# EAGLE design ardugilla-ver8 (EAGLE 9.5.1)
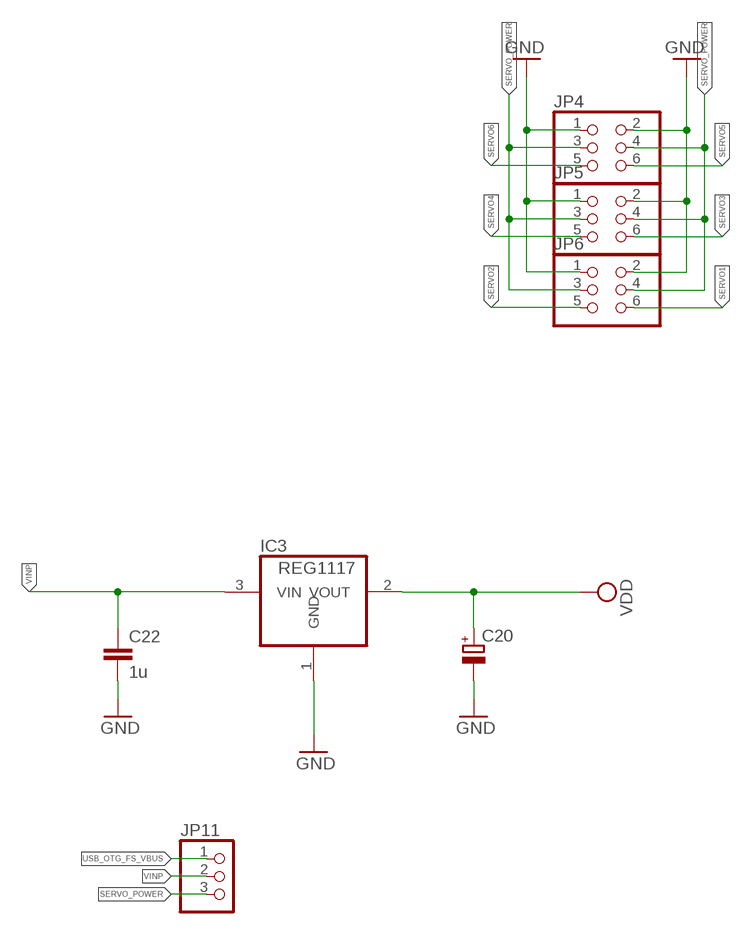
[diagram p0: schematic, sheet 1, part 1 of 2]
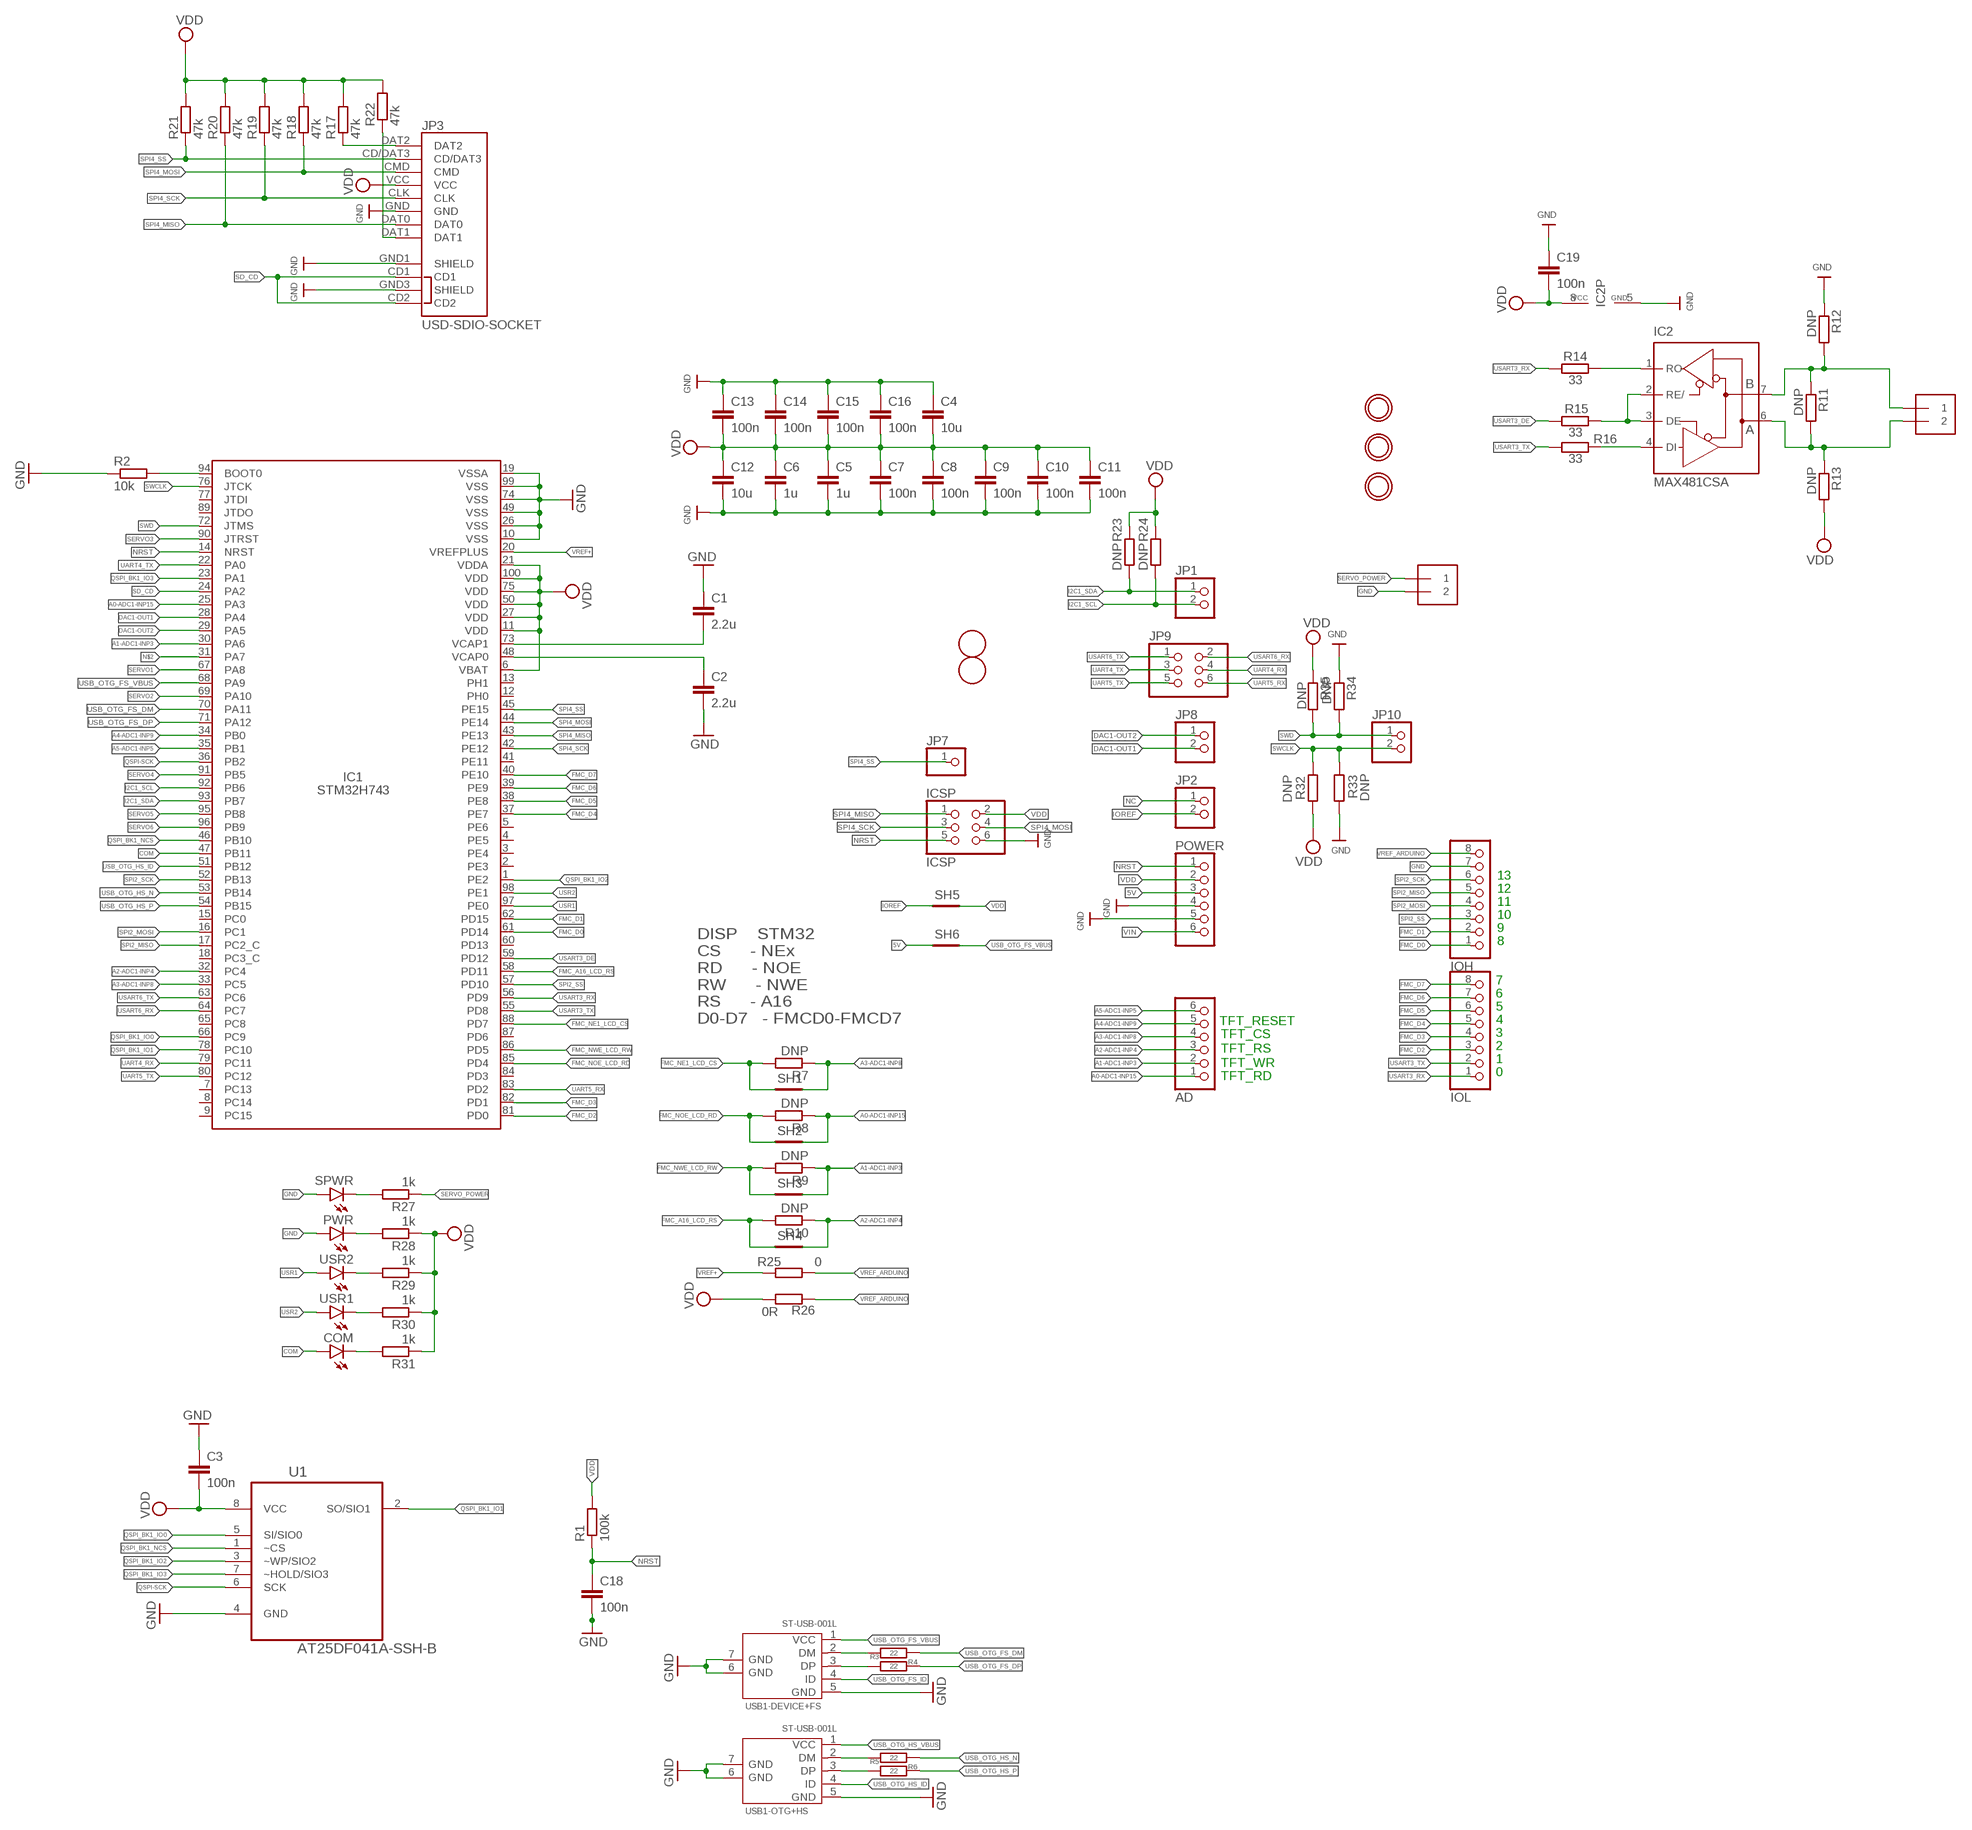
[diagram p1: schematic, sheet 1, part 2 of 2]

## Parts
AD  PINHD-1X6  [1X06]
C1  2.2u  C-EUC0603  [C0603]
C2  2.2u  C-EUC0603  [C0603]
C3  100n  C-EUC0603  [C0603]
C4  10u  C-EUC0603  [C0603]
C5  1u  C-EUC0603  [C0603]
C6  1u  C-EUC0603  [C0603]
C7  100n  C-EUC0603  [C0603]
C8  100n  C-EUC0603  [C0603]
C9  100n  C-EUC0603  [C0603]
C10  100n  C-EUC0603  [C0603]
C11  100n  C-EUC0603  [C0603]
C12  10u  C-EUC0603  [C0603]
C13  100n  C-EUC0603  [C0603]
C14  100n  C-EUC0603  [C0603]
C15  100n  C-EUC0603  [C0603]
C16  100n  C-EUC0603  [C0603]
C18  100n  C-EUC0603  [C0603]
C19  100n  C-EUC0603  [C0603]
C20  CPOL-EUE2-4  [E2-4]
C22  1u  C-EUC0603  [C0603]
COM  LEDSML0603  [SML0603]
IC1  STM32H743  STM32H743_753_LQFP100  [LQFP100_PACKAGE]
IC2  MAX481CSA  [SO08]
IC3  REG1117  [SOT223]
ICSP  ICSP  PINHD-2X3  [2X03]
IOH  PINHD-1X8  [1X08]
IOL  PINHD-1X8  [1X08]
J1  1X2-3.5MM  [1X2-3.5MM]
J2  1X2-3.5MM  [1X2-3.5MM]
JP1  PINHD-1X2  [1X02]
JP2  PINHD-1X2  [1X02]
JP3  USD-SDIO-SOCKET  [MICRO-SD-SOCKET-SDIO]
JP4  PINHD-2X3  [2X03]
JP5  PINHD-2X3  [2X03]
JP6  PINHD-2X3  [2X03]
JP7  PINHD-1X1CB  [1X01-CLEANBIG]
JP8  PINHD-1X2  [1X02]
JP9  PINHD-2X03_2.54-90°  [2X03/90]
JP10  PINHD-1X2  [1X02]
JP11  PINHD-1X3  [1X03]
POWER  PINHD-1X6  [1X06]
PWR  LEDSML0603  [SML0603]
R1  100k  R-EU_R0603  [R0603]
R2  10k  R-EU_R0603  [R0603]
R3  22  R-EU_R0603  [R0603]
R4  22  R-EU_R0603  [R0603]
R5  22  R-EU_R0603  [R0603]
R6  22  R-EU_R0603  [R0603]
R7  DNP  R-EU_R0402  [R0402]
R8  DNP  R-EU_R0402  [R0402]
R9  DNP  R-EU_R0402  [R0402]
R10  DNP  R-EU_R0402  [R0402]
R11  DNP  R-EU_R0603  [R0603]
R12  DNP  R-EU_R0603  [R0603]
R13  DNP  R-EU_R0603  [R0603]
R14  33  R-EU_R0402  [R0402]
R15  33  R-EU_R0402  [R0402]
R16  33  R-EU_R0402  [R0402]
R17  47k  R-EU_R0603  [R0603]
R18  47k  R-EU_R0603  [R0603]
R19  47k  R-EU_R0603  [R0603]
R20  47k  R-EU_R0603  [R0603]
R21  47k  R-EU_R0603  [R0603]
R22  47k  R-EU_R0603  [R0603]
R23  DNP  R-EU_R0603  [R0603]
R24  DNP  R-EU_R0603  [R0603]
R25  0  R-EU_R0603  [R0603]
R26  0R  R-EU_R0603  [R0603]
R27  1k  R-EU_R0402  [R0402]
R28  1k  R-EU_R0603  [R0603]
R29  1k  R-EU_R0402  [R0402]
R30  1k  R-EU_R0402  [R0402]
R31  1k  R-EU_R0603  [R0603]
R32  DNP  R-EU_R0603  [R0603]
R33  DNP  R-EU_R0603  [R0603]
R34  DNP  R-EU_R0603  [R0603]
R35  DNP  R-EU_R0603  [R0603]
SH1  SHORTT5  [SHORT_TOP-50]
SH2  SHORTT5  [SHORT_TOP-50]
SH3  SHORTT5  [SHORT_TOP-50]
SH4  SHORTT5  [SHORT_TOP-50]
SH5  SHORTT5  [SHORT_TOP-50]
SH6  SHORTT5  [SHORT_TOP-50]
SPWR  LEDSML0603  [SML0603]
U1  AT25DF041A-SSH-B  [SOIC127P600X175-8N]
U$3  FIDUCIALMOUNT  [FIDUCIA-MOUNT]
U$4  FIDUCIALMOUNT  [FIDUCIA-MOUNT]
U$12  MICROBUILDER_MOUNTINGHOLE3.0THIN  [MICROBUILDER_MOUNTINGHOLE_3.0_PLATEDTHIN]
U$13  MICROBUILDER_MOUNTINGHOLE3.0THIN  [MICROBUILDER_MOUNTINGHOLE_3.0_PLATEDTHIN]
U$14  MICROBUILDER_MOUNTINGHOLE3.0THIN  [MICROBUILDER_MOUNTINGHOLE_3.0_PLATEDTHIN]
USB1-DEVICE+FS  ST-USB-001L  MICRO-USB-SMD-TYPE-AB-R/A(ST-USB-001L)  [MICRO-USB5+2P-SMD-0.65]
USB1-OTG+HS  ST-USB-001L  MICRO-USB-SMD-TYPE-AB-R/A(ST-USB-001L)  [MICRO-USB5+2P-SMD-0.65]
USR1  LEDSML0603  [SML0603]
USR2  LEDSML0603  [SML0603]

## Nets
5V: POWER.3 SH6.1
A0-ADC1-INP15: AD.1 IC1.25(PA3) R8.1 SH2.2
A1-ADC1-INP3: AD.2 IC1.30(PA6) R9.1 SH3.2
A2-ADC1-INP4: AD.3 IC1.32(PC4) R10.1 SH4.2
A3-ADC1-INP8: AD.4 IC1.33(PC5) R7.1 SH1.2
A4-ADC1-INP9: AD.5 IC1.34(PB0)
A5-ADC1-INP5: AD.6 IC1.35(PB1)
COM: COM.A IC1.47(PB11)
DAC1-OUT1: IC1.28(PA4) JP8.2
DAC1-OUT2: IC1.29(PA5) JP8.1
FMC_A16_LCD_RS: IC1.58(PD11) R10.2 SH4.1
FMC_D0: IC1.61(PD14) IOH.1
FMC_D1: IC1.62(PD15) IOH.2
FMC_D2: IC1.81(PD0) IOL.3
FMC_D3: IC1.82(PD1) IOL.4
FMC_D4: IC1.37(PE7) IOL.5
FMC_D5: IC1.38(PE8) IOL.6
FMC_D6: IC1.39(PE9) IOL.7
FMC_D7: IC1.40(PE10) IOL.8
FMC_NE1_LCD_CS: IC1.88(PD7) R7.2 SH1.1
FMC_NOE_LCD_RD: IC1.85(PD4) R8.2 SH2.1
FMC_NWE_LCD_RW: IC1.86(PD5) R9.2 SH3.1
GND: C1.1 C2.2 C3.1 C4.1 C5.2 C6.2 C7.2 C8.2 C9.2 C10.2 C11.2 C12.2 C13.1 C14.1 C15.1 C16.1 C18.2 C19.1 C20.- C22.2 IC1.10(VSS) IC1.19(VSSA) IC1.26(VSS) IC1.49(VSS) IC1.74(VSS) IC1.99(VSS) IC2.5(GND) IC3.1(GND) ICSP.6 IOH.7 J2.2 JP3.GND JP3.GND1(SHIELD) JP3.GND3(SHIELD) JP4.1 JP4.2 JP5.1 JP5.2 JP6.1 JP6.2 POWER.4 POWER.5 PWR.A R2.1 R12.1 R33.2 R34.1 SPWR.A U1.4(GND) USB1-DEVICE+FS.5(GND) USB1-DEVICE+FS.6(GND) USB1-DEVICE+FS.7(GND) USB1-OTG+HS.5(GND) USB1-OTG+HS.6(GND) USB1-OTG+HS.7(GND)
I2C1_SCL: IC1.92(PB6) JP1.2 R24.1
I2C1_SDA: IC1.93(PB7) JP1.1 R23.1
IOREF: JP2.2 SH5.1
N$1: IC1.94(BOOT0) R2.2
N$2: IC1.31(PA7)
N$3: C1.2 IC1.73(VCAP1)
N$4: C2.1 IC1.48(VCAP0)
N$5: R27.2 SPWR.C
N$6: R3.2 USB1-DEVICE+FS.2(DM)
N$7: PWR.C R28.2
N$8: R4.2 USB1-DEVICE+FS.3(DP)
N$9: R5.2 USB1-OTG+HS.2(DM)
N$10: R6.2 USB1-OTG+HS.3(DP)
N$11: R29.2 USR2.C
N$12: R30.2 USR1.C
N$13: COM.C R31.2
N$21: IC2.2(RE/) IC2.3(DE) R15.2
N$22: IC2.4(DI) R16.2
N$23: IC2.1(RO) R14.2
N$25: IC2.7(B) J1.1 R11.1 R12.2
N$26: IC2.6(A) J1.2 R11.2 R13.1
NC: JP2.1
NRST: C18.1 IC1.14(NRST) ICSP.5 POWER.1 R1.1
QSPI-SCK: IC1.36(PB2) U1.6(SCK)
QSPI_BK1_IO0: IC1.66(PC9) U1.5(SI/SIO0)
QSPI_BK1_IO1: IC1.78(PC10) U1.2(SO/SIO1)
QSPI_BK1_IO2: IC1.1(PE2) U1.3(~WP/SIO2)
QSPI_BK1_IO3: IC1.23(PA1) U1.7(~HOLD/SIO3)
QSPI_BK1_NCS: IC1.46(PB10) U1.1(~CS)
SD_CD: IC1.24(PA2) JP3.CD1 JP3.CD2
SD_DAT1: JP3.DAT1 R22.1
SD_DAT2: JP3.DAT2 R17.1
SERVO1: IC1.67(PA8) JP6.6
SERVO2: IC1.69(PA10) JP6.5
SERVO3: IC1.90(JTRST) JP5.6
SERVO4: IC1.91(PB5) JP5.5
SERVO5: IC1.95(PB8) JP4.6
SERVO6: IC1.96(PB9) JP4.5
SERVO_POWER: J2.1 JP4.3 JP4.4 JP5.3 JP5.4 JP6.3 JP6.4 JP11.3 R27.1
SPI2_MISO: IC1.17(PC2_C) IOH.5
SPI2_MOSI: IC1.16(PC1) IOH.4
SPI2_SCK: IC1.52(PB13) IOH.6
SPI2_SS: IC1.57(PD10) IOH.3
SPI4_MISO: IC1.43(PE13) ICSP.1 JP3.DAT0 R20.1
SPI4_MOSI: IC1.44(PE14) ICSP.4 JP3.CMD R18.1
SPI4_SCK: IC1.42(PE12) ICSP.3 JP3.CLK R19.1
SPI4_SS: IC1.45(PE15) JP3.CD/DAT3 JP7.1 R21.1
SWCLK: IC1.76(JTCK) JP10.2 R32.1 R33.1
SWD: IC1.72(JTMS) JP10.1 R34.2 R35.2
UART4_RX: IC1.79(PC11) JP9.4
UART4_TX: IC1.22(PA0) JP9.3
UART5_RX: IC1.83(PD2) JP9.6
UART5_TX: IC1.80(PC12) JP9.5
USART3_DE: IC1.59(PD12) R15.1
USART3_RX: IC1.56(PD9) IOL.1 R14.1
USART3_TX: IC1.55(PD8) IOL.2 R16.1
USART6_RX: IC1.64(PC7) JP9.2
USART6_TX: IC1.63(PC6) JP9.1
USB_OTG_FS_DM: IC1.70(PA11) R3.1
USB_OTG_FS_DP: IC1.71(PA12) R4.1
USB_OTG_FS_ID: USB1-DEVICE+FS.4(ID)
USB_OTG_FS_VBUS: IC1.68(PA9) JP11.1 SH6.2 USB1-DEVICE+FS.1(VCC)
USB_OTG_HS_ID: IC1.51(PB12) USB1-OTG+HS.4(ID)
USB_OTG_HS_N: IC1.53(PB14) R5.1
USB_OTG_HS_P [diff-pair]: IC1.54(PB15) R6.1
USB_OTG_HS_VBUS: USB1-OTG+HS.1(VCC)
USR1: IC1.97(PE0) USR2.A
USR2: IC1.98(PE1) USR1.A
VDD: C3.2 C4.2 C5.1 C6.1 C7.1 C8.1 C9.1 C10.1 C11.1 C12.1 C13.2 C14.2 C15.2 C16.2 C19.2 C20.+ IC1.6(VBAT) IC1.11(VDD) IC1.21(VDDA) IC1.27(VDD) IC1.50(VDD) IC1.75(VDD) IC1.100(VDD) IC2.8(VCC) IC3.2(VOUT) ICSP.2 JP3.VCC POWER.2 R1.2 R13.2 R17.2 R18.2 R19.2 R20.2 R21.2 R22.2 R23.2 R24.2 R26.2 R28.1 R29.1 R30.1 R31.1 R32.2 R35.1 SH5.2 U1.8(VCC)
VIN: POWER.6
VINP: C22.1 IC3.3(VIN) JP11.2
VREF+: IC1.20(VREFPLUS) R25.2
VREF_ARDUINO: IOH.8 R25.1 R26.1
Unconnected: IC1.2(PE3) IC1.3(PE4) IC1.4(PE5) IC1.5(PE6) IC1.7(PC13) IC1.8(PC14) IC1.9(PC15) IC1.12(PH0) IC1.13(PH1) IC1.15(PC0) IC1.18(PC3_C) IC1.41(PE11) IC1.60(PD13) IC1.65(PC8) IC1.77(JTDI) IC1.84(PD3) IC1.87(PD6) IC1.89(JTDO)

## Notes on the sheet
- 13
- 12
- 11
- 10
- 9
- 8
- 7
- 6
- 5
- DISP    STM32
  CS      - NEx
  RD      - NOE 
  RW      - NWE
  RS      - A16
  D0-D7   - FMCD0-FMCD7
- TFT_RESET | 4
- TFT_CS | 3
- TFT_RS | 2
- 1
- TFT_WR
- 0
- TFT_RD

## Library data of the parts
AD POWER = pinhead:PINHD-1X6: PIN HEADER
C1-C16 C18 C19 C22 = rcl:C-EU: CAPACITOR, European symbol; SPICEPREFIX: C
C20 = rcl:CPOL-EU: POLARIZED CAPACITOR, European symbol; SPICEPREFIX: C
COM PWR SPWR USR1 USR2 = led:LED: LED OSRAM: - CHIPLED LG R971, LG N971, LY N971, LG Q971, LY Q971, LO R971, LY R971 LH N974, LH R974 LS Q976, LO Q976, LY Q976 LO Q996 - Hyper CHIPLED LW Q18S LB Q993, LB Q99A, LB R99A - SideLED LS A670, LO A670, LY A670, LG A670, LP A670 LB A673, LV A673, LT A673, LW A673 LH A674 LY A675 LS A676, LA A676, LO A676, LY A676, LW A676 LS A679, LY A679, LG A679 - Hyper Micro SIDELED® LS Y876, LA Y876, LO Y876, LY Y876 LT Y87S - SmartLED LW L88C, LW L88S LB L89C, LB L89S, LG L890 LS L89K, LO L89K, LY L89K LS L896, LA L896, LO L896, LY L896 - TOPLED LS T670, LO T670, LY T670, LG T670, LP T670 LSG T670, LSP T670, LSY T670, LOP T670, LYG T670 LG T671, LOG T671, LSG T671 LB T673, LV T673, LT T673, LW T673 LH T674 LS T676, LA T676, LO T676, LY T676, LB T676, LH T676, LSB T676, LW T676 LB T67C, LV T67C, LT T67C, LS T67K, LO T67K, LY T67K, LW E67C LS E67B, LA E67B, LO E67B, LY E67B, LB E67C, LV E67C, LT E67C LW T67C LS T679, LY T679, LG T679 LS T770, LO T770, LY T770, LG T770, LP T770 LB T773, LV T773, LT T773, LW T773 LH T774 LS E675, LA E675, LY E675, LS T675 LS T776, LA T776, LO T776, LY T776, LB T776 LHGB T686 LT T68C, LB T68C - Hyper Mini TOPLED® LB M676 - Mini TOPLED Santana® LG M470 LS M47K, LO M47K, LY M47K Source: http://www.osram.convergy.de LUXEON: - LUMILED® LXK2-PW12-R00, LXK2-PW12-S00, LXK2-PW14-U00, LXK2-PW14-V00 LXK2-PM12-R00, LXK2-PM12-S00, LXK2-PM14-U00 LXK2-PE12-Q00, LXK2-PE12-R00, LXK2-PE12-S00, LXK2-PE14-T00, LXK2-PE14-U00 LXK2-PB12-K00, LXK2-PB12-L00, LXK2-PB12-M00, LXK2-PB14-N00, LXK2-PB14-P00, LXK2-PB14-Q00 LXK2-PR12-L00, LXK2-PR12-M00, LXK2-PR14-Q00, LXK2-PR14-R00 LXK2-PD12-Q00, LXK2-PD12-R00, LXK2-PD12-S00 LXK2-PH12-R00, LXK2-PH12-S00 LXK2-PL12-P00, LXK2-PL12-Q00, LXK2-PL12-R00 Source: www.luxeon.com KINGBRIGHT: KA-3528ASYC Source: www.kingbright.com
IC1 = STM32_PJ:STM32H743_753_LQFP100: STM32H743_753_LQFP100 edit this description Auto generated by make-symbol-device-package-bsdl.ulp Rev. 44 Source: STM32H743_753_LQFP100.bsd
IC2 = maxim:MAX481CSA: RS485 TRANSEIVER; MF: MAXIM; MPN: MAX481CSA; OC_FARNELL: unknown; OC_NEWARK: 90C3817
IC3 = burr-brown:REG1117: 800mA and 1A Low Dropout (LDO) Positive Regulator 1.8V, 2.5V, 2.85V, 3.3V, 5V, and Adj; MPN: REG1117; OC_FARNELL: 1097566; OC_NEWARK: 14P6981
ICSP JP4-JP6 = pinhead:PINHD-2X3: PIN HEADER
IOH IOL = pinhead:PINHD-1X8: PIN HEADER
J1 J2 = adafruit:1X2: 3.5mm Terminal block http://www.ladyada.net/library/pcb/eaglelibrary.html
JP1 JP2 JP8 JP10 = pinhead:PINHD-1X2: PIN HEADER
JP3 = SparkFun-Connectors:USD-SDIO-SOCKET: microSD Socket Push-push type uSD socket with full SDIO signal mapping. Spark Fun Electronics SKU : PRT-00127. tDoc lines correctly indicate media card edge positions when inserting (unlocked, locked, depressed). NOTE: CD1 and CD2 are connected internally, and short to ground when card is removed.; PROD_ID: CONN-07820
JP7 = adafruit:PINHD-1X1: Pin header 1x1 for 0.1" spacing With round pins
JP9 = pinhead-2:PINHD-2X03: PIN HEADER
JP11 = pinhead:PINHD-1X3: PIN HEADER
R1-R35 = resistor:R-EU_: RESISTOR, European symbol
SH1-SH6 = shorts:SHORT: Short between two nets; BOM: no
U1 = Atmel_By_element14_Batch_1-00:AT25DF041A-SSH-B: Serial Flash Memory; MPN: AT25DF041A-SSH-B; OC_FARNELL: 1715441; OC_NEWARK: 15R0306; PACKAGE: SOIC-8; SUPPLIER: Atmel
U$3 U$4 = SmartPrj:FIDUCIALMOUNT
U$12-U$14 = Adafruit PCA9685:MICROBUILDER_MOUNTINGHOLE: Mounting Hole For #2 screws (0.086"/2.18mm width, 0.094"/2.4mm hole) use 2.5mm
USB1-DEVICE+FS USB1-OTG+HS = Seeed-OPL-Connector:MICRO-USB-SMD-TYPE-AB-R/A(ST-USB-001L): 320010012; MPN: ST-USB-001L

## Net classes
0 default: width 0.152 mm, drill 0.305 mm, clearance 0.152 mm
1 diff-pair: width 1.27 mm
2 diff-pair-narrow: width 0.305 mm, drill 0.305 mm, clearance 0.203 mm

## Board
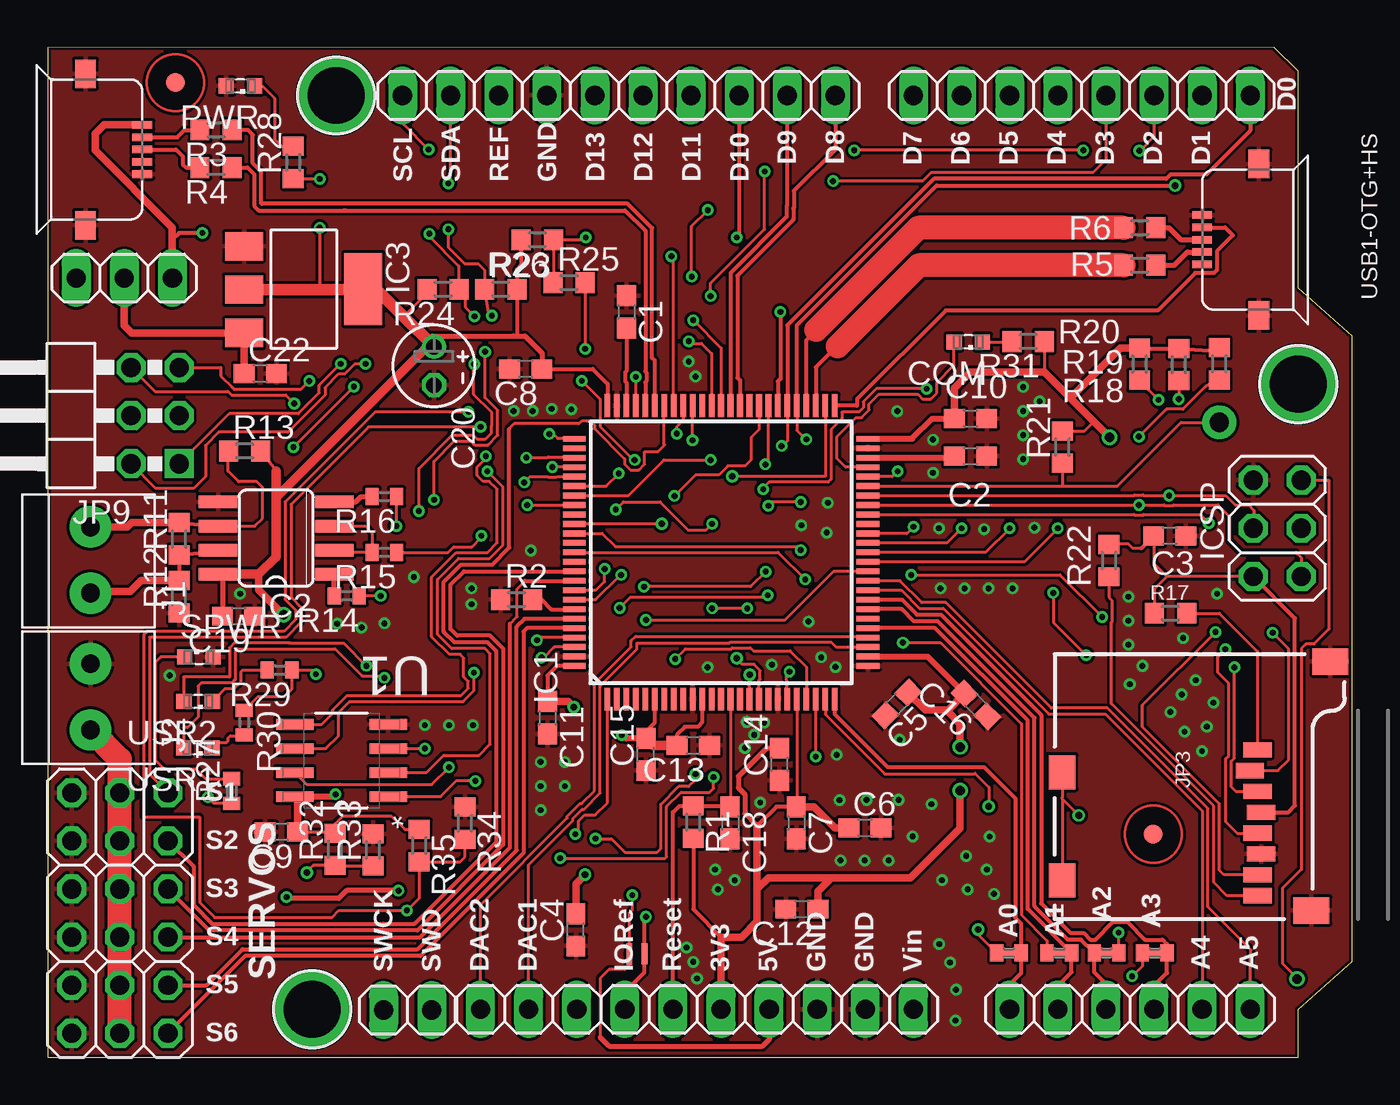
[diagram p2: board, top side]
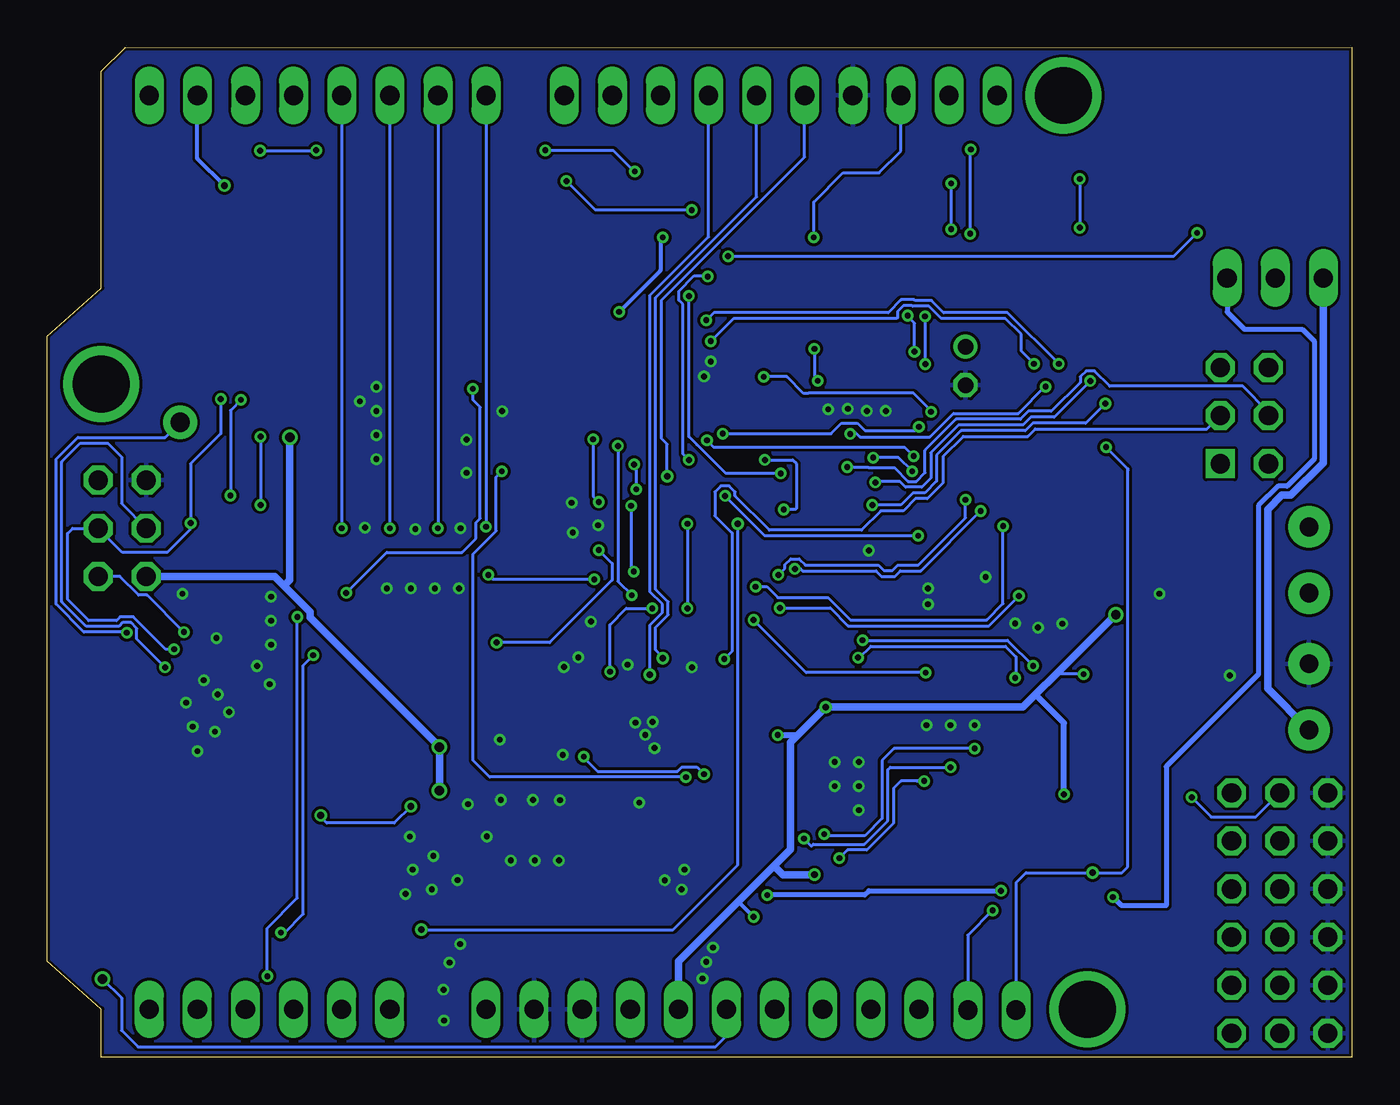
[diagram p3: board, bottom side, seen from below]

Size 68.89 x 53.34 mm. Coordinates in mm from the lower left corner, seen from the top.
Outline: 0,53.33 64.77,53.34 64.77,53.33 66.04,52.07 66.04,40.63 68.89,38.09 68.89,5.08 66.04,2.54 66.04,0 0,0 0,53.34
Copper layers (1*16): Top 0.035mm / dielectric 1.5mm / Bottom 0.035mm
Design rules "default *": minimum track width 6mil, minimum drill 11mil, track to track 6mil, track to pad 6mil, pad to pad 6mil, via to via 6mil, smd to smd 6mil, copper to edge 6mil, drill to drill 6mil, minimum pad ring 6mil, minimum via ring 6mil, stop-mask expansion 6mil, vias tented up to drill 0mil, thermal gap 6mil

### Footprints (pad centres in the part's own frame; a part is rotated, then mirrored left to right if it is on the bottom)
1X06 = drill 1.016 long: 1 -6.35,0; 2 -3.81,0; 3 -1.27,0; 4 1.27,0; 5 3.81,0; 6 6.35,0
C0603 = smd 1.1 x 1: 1 -0.85,0; 2 0.85,0
E2-4 = drill 0.813 pad 1.27: + -1.016,0 | drill 0.813 pad 1.27 octagon: - 1.016,0
SML0603 = smd 0.8 x 0.8: A 0.75,0; C -0.75,0
LQFP100_PACKAGE = smd 1.2 x 0.3: 1 -7.75,6; 2 -7.75,5.5; 3 -7.75,5; 4 -7.75,4.5; 5 -7.75,4; 6 -7.75,3.5; 7 -7.75,3; 8 -7.75,2.5; 9 -7.75,2; 10 -7.75,1.5; 11 -7.75,1; 12 -7.75,0.5; 13 -7.75,0; 14 -7.75,-0.5; 15 -7.75,-1; 16 -7.75,-1.5; 17 -7.75,-2; 18 -7.75,-2.5; 19 -7.75,-3; 20 -7.75,-3.5; 21 -7.75,-4; 22 -7.75,-4.5; 23 -7.75,-5; 24 -7.75,-5.5; 25 -7.75,-6; 51 7.75,-6; 52 7.75,-5.5; 53 7.75,-5; 54 7.75,-4.5; 55 7.75,-4; 56 7.75,-3.5; 57 7.75,-3; 58 7.75,-2.5; 59 7.75,-2; 60 7.75,-1.5; 61 7.75,-1; 62 7.75,-0.5; 63 7.75,0; 64 7.75,0.5; 65 7.75,1; 66 7.75,1.5; 67 7.75,2; 68 7.75,2.5; 69 7.75,3; 70 7.75,3.5; 71 7.75,4; 72 7.75,4.5; 73 7.75,5; 74 7.75,5.5; 75 7.75,6 | smd 0.3 x 1.2: 26 -6,-7.75; 27 -5.5,-7.75; 28 -5,-7.75; 29 -4.5,-7.75; 30 -4,-7.75; 31 -3.5,-7.75; 32 -3,-7.75; 33 -2.5,-7.75; 34 -2,-7.75; 35 -1.5,-7.75; 36 -1,-7.75; 37 -0.5,-7.75; 38 0,-7.75; 39 0.5,-7.75; 40 1,-7.75; 41 1.5,-7.75; 42 2,-7.75; 43 2.5,-7.75; 44 3,-7.75; 45 3.5,-7.75; 46 4,-7.75; 47 4.5,-7.75; 48 5,-7.75; 49 5.5,-7.75; 50 6,-7.75; 76 6,7.75; 77 5.5,7.75; 78 5,7.75; 79 4.5,7.75; 80 4,7.75; 81 3.5,7.75; 82 3,7.75; 83 2.5,7.75; 84 2,7.75; 85 1.5,7.75; 86 1,7.75; 87 0.5,7.75; 88 0,7.75; 89 -0.5,7.75; 90 -1,7.75; 91 -1.5,7.75; 92 -2,7.75; 93 -2.5,7.75; 94 -3,7.75; 95 -3.5,7.75; 96 -4,7.75; 97 -4.5,7.75; 98 -5,7.75; 99 -5.5,7.75; 100 -6,7.75
SO08 = smd 0.66 x 2.032: 1 -1.905,-3.073; 2 -0.635,-3.073; 3 0.635,-3.073; 4 1.905,-3.073; 5 1.905,3.073; 6 0.635,3.073; 7 -0.635,3.073; 8 -1.905,3.073
SOT223 = smd 1.499 x 2.007: 1 -2.261,-3.15; 2 0.025,-3.15; 3 2.311,-3.15 | smd 3.81 x 2.007: 4 0,3.15
2X03 = drill 1.016 octagon: 1 -2.54,-1.27; 2 -2.54,1.27; 3 0,-1.27; 4 0,1.27; 5 2.54,-1.27; 6 2.54,1.27
1X08 = drill 1.016 long: 1 -8.89,0; 2 -6.35,0; 3 -3.81,0; 4 -1.27,0; 5 1.27,0; 6 3.81,0; 7 6.35,0; 8 8.89,0
1X2-3.5MM = drill 1 pad 2.184: 1 1.8,0; 2 -1.7,0
1X02 = drill 1.016 long: 1 -1.27,0; 2 1.27,0
MICRO-SD-SOCKET-SDIO = smd 1.8 x 1.4: CD1 11.92,0.4; CD2 6.22,0.4 | smd 0.8 x 1.5: CD/DAT3 6.13,10.3; CLK 9.43,10.7; CMD 7.23,10.7; DAT0 11.63,10.7; DAT1 12.73,10.7; DAT2 5.03,10.7; GND 10.53,10.9; VCC 8.33,10.9 | smd 1.4 x 1.9: GND1 0.37,14.55; GND3 13.52,13.55
1X01-CLEANBIG = drill 1.016 pad 1.778: 1 0,0
2X03/90 = drill 1.016 square: 1 -2.54,-6.35 | drill 1.016 octagon: 2 -2.54,-3.81; 3 0,-6.35; 4 0,-3.81; 5 2.54,-6.35; 6 2.54,-3.81
1X03 = drill 1.016 long: 1 -2.54,0; 2 0,0; 3 2.54,0
R0603 = smd 1 x 1.1: 1 -0.85,0; 2 0.85,0
R0402 = smd 0.7 x 0.9: 1 -0.65,0; 2 0.65,0
SHORT_TOP-50 = smd 0.61 x 0.305: 1 0.254,0; 2 -0.254,0
SOIC127P600X175-8N = smd 1.981 x 0.559: 1 -2.464,1.905; 2 -2.464,0.635; 3 -2.464,-0.635; 4 -2.464,-1.905; 5 2.464,-1.905; 6 2.464,-0.635; 7 2.464,0.635; 8 2.464,1.905
FIDUCIA-MOUNT = smd 1.016 x 1.016: P$1 0,0
MICROBUILDER_MOUNTINGHOLE_3.0_PLATEDTHIN = drill 3 pad 3.6: P$1 0,0
MICRO-USB5+2P-SMD-0.65 = smd 0.4 x 1.05: 1 -1.3,0; 2 -0.65,0; 3 0,0; 4 0.65,0; 5 1.3,0 | smd 1.5 x 1.1: 6 4,-3; 7 -4,-3

### Placement (x,y rotation side)
AD  57.15,2.54 0 top
C1  30.56,39.37 270 top
C2  48.74,31.75 0 top
C3  59.25,27.54 180 top
C4  27.89,6.73 90 top
C5  44.83,18.67 225 top
C6  43.16,12.13 0 top
C7  39.53,12.38 270 top
C8  25.24,36.35 180 top
C9  12.34,11.91 180 top
C10  48.74,33.73 0 top
C11  26.39,17.94 270 top
C12  39.83,7.83 180 top
C13  34.09,16.47 180 top
C14  38.66,15.48 90 top
C15  31.59,15.99 90 top
C16  49.01,18.61 135 top
C18  36.04,12.38 270 top
C19  10.08,23.3 180 top
C20  20.4,36.51 270 top
C22  11.23,36.12 0 top
COM  48.62,37.78 180 top
IC1  35.56,26.67 90 top
IC2  12.06,27.42 90 top
IC3  13.52,40.57 270 top
ICSP  64.93,27.94 90 top
IOH  32.7,50.8 180 top
IOL  54.61,50.8 180 top
J1  2.26,26.31 270 top
J2  2.26,19.09 270 top
JP1  20,50.8 180 top
JP2  29.21,2.54 0 top
JP3  53.18,21.27 270 top
JP4  3.81,2.54 0 top
JP5  3.81,7.62 0 top
JP6  3.81,12.7 0 top
JP7  61.87,33.54 0 top
JP8  24.13,2.54 0 top
JP9  0.6,33.89 90 top
JP10  19.01,2.5 180 top
JP11  4.05,41.16 180 top
POWER  39.37,2.54 0 top
PWR  10.18,51.3 180 top
R1  34.09,12.42 270 top
R2  24.77,24.17 0 top
R3  8.89,48.97 180 top
R4  8.89,46.99 180 top
R5  57.67,41.83 0 top
R6  57.67,43.81 0 top
R7  58.46,5.52 180 top
R8  50.76,5.52 180 top
R9  53.42,5.52 180 top
R10  55.92,5.52 0 top
R11  6.95,27.38 90 top
R12  6.95,24.33 90 top
R13  10.4,32.03 0 top
R14  15.8,24.37 180 top
R15  17.78,26.67 180 top
R16  17.78,29.61 180 top
R17  59.29,23.46 180 top
R18  57.66,36.61 90 top
R19  59.73,36.59 90 top
R20  61.87,36.63 90 top
R21  53.58,32.23 90 top
R22  56.04,26.23 90 top
R23  23.93,40.56 0 top
R24  20.88,40.56 180 top
R25  27.54,40.91 0 top
R26  25.86,43.18 180 top
R27  9.72,14.07 90 top
R28  12.97,47.26 90 top
R29  12.25,20.45 180 top
R30  10.39,17.68 270 top
R31  51.77,37.81 180 top
R32  15.18,10.98 90 top
R33  17.18,10.96 90 top
R34  22.04,12.37 270 top
R35  19.62,11.18 270 top
SH1  58.54,5.52 180 top
SH2  50.78,5.52 180 top
SH3  53.44,5.48 180 top
SH4  55.9,5.52 0 top
SH5  31.51,5.48 270 top
SH6  30.72,5.45 270 top
SPWR  7.99,21.14 0 top
U1  15.52,15.68 180 top
U$3  58.38,11.79 180 top
U$4  6.75,51.47 180 top
U$12  66.04,35.56 0 top
U$13  13.97,2.54 0 top
U$14  15.24,50.8 0 top
USB1-DEVICE+FS  5,47.94 270 top
USB1-OTG+HS  60.96,43.18 90 top
USR1  7.93,16.34 180 top
USR2  7.95,18.8 180 top

### Tracks (layer width: path | path; a pad name or v marks a point on that pad's centre or on a via)
5V
  Top 0.152: 29.17,1.07 29.17,4.17 29.65,4.64 30.48,4.64 30.72,4.88 SH6.1
  Top 0.254: 29.17,1.07 29.65,0.59 37.74,0.59 38.14,0.99 38.14,2.5 POWER.3
A0-ADC1-INP15
  Top 0.152: R8.1 SH2.2
  Top 0.203: AD.1 50.8,3.85 51.41,4.46 R8.1 51.4,5.53 51.4,7.07 51.09,7.38 51.09,13.68 49.44,15.33 44.36,15.33 41.56,18.13 IC1.25
A1-ADC1-INP3
  Top 0.152: SH3.2 53.73,5.52 R9.1
  Top 0.203: AD.2 53.34,3.77 54.07,4.5 R9.1 51.75,7.83 51.75,17.78 46.86,22.67 IC1.30
A2-ADC1-INP4
  Top 0.152: SH4.2 R10.1 56.36,5.52
  Top 0.203: AD.3 55.88,3.89 55.27,4.5 R10.1 54.57,6.22 53.87,6.22 52.11,7.98 52.11,17.93 47.01,23.03 45.75,23.03 45.11,23.67 IC1.32
A3-ADC1-INP8
  Top 0.152: R7.1 SH1.2
  Top 0.203: AD.4 58.42,3.77 59.11,4.46 R7.1 59.11,5.98 58.86,6.23 58.85,6.22 57.95,6.22 57.02,7.15 56.24,7.15 55.32,6.22 55.07,6.22 54.71,6.58 54.02,6.58 52.46,8.13 52.46,18.08 47.16,23.38 45.9,23.38 45.11,24.17 IC1.33
A4-ADC1-INP9
  Top 0.152: IC1.34 45.08,24.67 46.04,23.71 47.29,23.71 52.87,18.14 55.84,18.14 60.96,13.02 AD.5
A5-ADC1-INP5
  Top 0.152: AD.6 63.5,5.2 63.54,5.24 63.54,5.67 61.27,7.95 61.27,13.14 55.97,18.44 52.99,18.44 47.42,24.02 46.16,24.02 45.02,25.16 IC1.35
COM
  Top 0.152: IC1.47 42.13,31.17 41.67,31.63 41.67,32.78 42.67,33.78 42.98,33.78 43.38,34.19 43.38,34.5 43.89,35.02 45.95,35.02 46.19,34.78 46.64,34.78 46.95,35.09 46.95,35.64 47.87,36.55 COM.A
DAC1-OUT1
  Top 0.152: JP8.2 25.4,10.18 27.74,12.51 27.74,12.61 28.23,13.1 28.33,13.1 29.18,13.96 29.18,19.61 31.12,21.55 31.12,21.88 35.98,21.88 36.04,21.93 41.37,21.93 41.63,21.67 IC1.28
DAC1-OUT2
  Top 0.152: JP8.1 22.86,8.07 27.43,12.64 27.43,12.74 28.1,13.41 28.2,13.41 28.88,14.08 28.88,19.74 30.82,21.68 30.82,22.01 31.05,22.24 43.24,22.24 IC1.29
FMC_A16_LCD_RS  (via drill 0.3)
  Top 0.152: v54.85,21.23 53.14,22.94 53.14,24.49 v53.1,24.53 | v46.41,35.31 46.41,35.31 46.4,35.32 43.77,35.32 43.07,34.63 43.07,34.31 42.85,34.09 41.95,34.09 41.94,34.08 41.94,33.73 41.37,33.15 41.37,30.53 41.21,30.37 38.1,30.37 37.78,30.06 v37.78,30 | IC1.58 | v56.55,6.59 56.55,5.91 SH4.1 R10.2 | v37.9,31.31 38.06,31.47 IC1.58
  Bottom 0.152: v56.55,6.59 56.36,6.59 55.38,7.57 55.38,20.7 v54.85,21.23 | v53.1,24.53 50.96,26.67 46.99,26.67 46.25,27.41 46.25,28.24 46.02,28.47 46.02,34.33 46.41,34.72 v46.41,35.31 | v37.78,30 37.78,31.19 v37.9,31.31
FMC_D0
  Top 0.203: IOH.1 41.59,47.94 39.41,45.76 39.41,44.86 39.38,44.83 39.38,44.24 36.42,41.28 36.42,35.9 36.56,35.75 IC1.61
FMC_D1
  Top 0.203: IOH.2 39.05,45.01 39.03,44.98 39.03,44.39 36.06,41.43 IC1.62
FMC_D2  (via drill 0.3)
  Top 0.152: IC1.81 29.5,30.17 v30.16,30.84 | v35,40.2 35,40.88 37.86,43.74 v37.86,46.79 | IOL.3 58.42,48.62 57.67,47.86 v57.65,47.88 | v54.69,47.9 v42.59,47.9
  Bottom 0.152: v30.16,30.84 33.06,30.84 34.59,32.36 35,32.78 v35,40.2 | v57.65,47.88 54.71,47.88 v54.69,47.9 | v42.59,47.9 39.01,47.9 37.9,46.79 v37.86,46.79
FMC_D3  (via drill 0.3)
  Top 0.152: IOL.4 55.88,47.4 55.2,46.72 46.65,46.72 46.2,46.28 v41.47,46.28 | IC1.82 30.66,29.67 32.54,31.55 v35,31.55 | v34.01,41.23 34.01,43.9 v34.86,44.75
  Bottom 0.152: v35,31.55 35.32,31.87 35.32,39.77 35.54,39.98 35.54,40.46 34.73,41.27 34.05,41.27 v34.01,41.23 | v34.86,44.75 39.95,44.75 v41.47,46.28
FMC_D4  (via drill 0.3)
  Top 0.152: v53.34,27.94 51.57,26.17 IC1.37
  Bottom 0.152: IOL.5 v53.34,27.94
FMC_D5  (via drill 0.3)
  Top 0.152: v50.8,27.94 49.53,26.67 IC1.38
  Bottom 0.152: IOL.6 v50.8,27.94
FMC_D6  (via drill 0.3)
  Top 0.152: v48.26,27.94 47.49,27.17 IC1.39
  Bottom 0.152: IOL.7 v48.26,27.94
FMC_D7  (via drill 0.3)
  Top 0.152: v45.72,28.02 45.36,27.66 IC1.40
  Bottom 0.152: IOL.8 v45.72,28.02
FMC_NE1_LCD_CS  (via drill 0.3)
  Top 0.152: v57.27,4.29 57.83,4.84 57.81,4.86 R7.2 SH1.1 | IC1.88 38.58,26.67 v40.01,25.24 | v45.6,25.48 53.46,25.48 v55.68,23.26
  Bottom 0.152: v55.68,23.26 55.68,8.41 57.27,6.83 v57.27,4.29 | v40.01,25.24 45.36,25.24 v45.6,25.48
FMC_NOE_LCD_RD  (via drill 0.35)
  Top 0.152: v32.42,28.18 v32.42,28.17 IC1.85 | v49.13,6.75 49.13,6.49 R8.2 SH2.1
  Bottom 0.152: v49.13,6.75 35.84,6.75 32.42,10.16 v32.42,28.18
FMC_NWE_LCD_RW  (via drill 0.3)
  Top 0.152: IC1.86 29.28,27.67 29.98,26.98 39.58,26.98 v39.77,26.79 | v45.16,21.91 47.13,21.91 51.42,17.62 51.42,7.51 52.77,6.17 R9.2 53.14,5.52 SH3.1
  Bottom 0.152: v39.77,26.79 39.06,26.08 39.06,25.2 42.35,21.91 v45.16,21.91
GND  (via drill 0.3)
  other vias: 47.07,27.94 49.45,27.9 52.11,27.98 26.04,15.6 27.3,15.6 26.04,14.33 26.04,13.06 27.3,14.33 34.09,5.04 33.73,5.79 34.29,4.17 22.38,24.77 22.38,23.93 37.62,13.45 35.24,9.91 36.82,16.34 41.66,15.98 44.99,16.78 36.93,17.71 37.83,17.68 37.32,17.03 25.5,26.77 46.75,32.62 46.75,30.88 51.51,35.4 51.51,34.13 51.51,32.86 51.51,31.59 47.15,24.77 48.42,24.77 49.69,24.77 50.96,24.77 57.07,24.33 57.07,23.06 57.07,21.79 57.81,20.67 57.15,19.71 61.75,24.49 59.95,22.15 33.85,36.75 34.21,35.96 38.24,20.74 40.18,23.02 40.85,21.12 41.6,20.62 34.85,20.6 17.78,22.92 15.29,22.91 19.34,25.37 16.58,22.7 22.46,17.54 21.19,17.54 19.92,17.54 41.82,13.58 43.24,13.6 47.94,1.95 47.96,3.58 47.65,5.01 47.09,5.99 49.59,9.91 48.59,8.87 49.97,8.63 47.23,9.37 48.5,10.64 49.74,11.65 44.94,13.6 41.87,10.4 43.14,10.4 44.41,10.4 45.68,11.67 46.67,13.37 60.63,19.91 59.29,18.24 61.56,18.73 59.89,19.17 60.04,17.2 61.21,17.46 60.96,16.18 36.29,9.35 35.4,8.87 52.38,34.65 24.61,34.13 25.61,34.13 26.62,34.26 27.66,34.23 6.45,20.17 10.16,24.48 44.87,34.13 41.2,29.29 41.14,27.71 39.8,28.1
  pour Bottom: -2.54,54.61 71.12,54.61 71.12,-1.27 -2.54,-1.27
  pour Top: -5.08,57.15 73.66,57.15 73.66,-3.81 -5.08,-3.81
I2C1_SCL  (via drill 0.3)
  Top 0.152: IC1.92 28.96,24.67 29.41,25.12 v29.41,25.8 | v22.52,36.61 22.54,36.59 22.5,36.55 22.5,35 23.45,34.05 23.45,33.38 23.43,33.35 23.43,32.96 23.12,32.65 22.68,32.65 22.46,32.86 21.36,32.86 19.61,31.11 v19.61,28.85 | JP1.2 18.73,49.33 v20.12,47.94 | v20.16,43.5 20.16,43.34 21.71,41.79 21.71,40.58 R24.1 22.05,40.24 22.05,39.63 v22.54,39.13
  Bottom 0.152: v22.52,36.61 22.52,39.03 22.5,39.05 22.5,39.09 v22.54,39.13 | v20.12,47.94 20.16,47.9 v20.16,43.5 | v29.41,25.8 29.11,25.8 29,25.69 25.13,25.69 24.83,25.39 24.14,25.39 23.84,25.69 22.77,25.69 v19.61,28.85
I2C1_SDA  (via drill 0.3)
  Top 0.152: IC1.93 28.93,24.17 30.24,25.48 v30.28,25.48 | v20.4,29.45 20.4,31.47 21.47,32.54 22.35,32.54 22.55,32.34 23.25,32.34 23.76,32.85 23.76,34.18 23.1,34.84 v23.1,37.27 | v23.45,39.17 23.28,39.34 R23.1 23.08,41.57 22.74,41.91 22.02,41.91 21.15,42.78 v21.15,43.74 | v21.15,46.16 21.27,46.28 JP1.1
  Bottom 0.152: v30.28,25.48 29.94,25.82 29.94,26.02 29.63,26.33 29.19,26.33 28.85,26 25,26 24.71,25.7 24.27,25.7 23.97,26 22.9,26 20.4,28.5 v20.4,29.45 | v23.45,39.17 23.45,39.13 23.1,38.77 v23.1,37.27 | v21.15,43.74 v21.15,46.16
IOREF
  Top 0.152: 31.51,5.08 SH5.1
  Top 0.203: JP2.2 30.48,3.45 31.51,4.49 31.51,5.08 31.51,5.17
N$1
  Top 0.203: R2.2 26.07,24.17 26.59,23.65 27.79,23.65 IC1.94
N$3
  Top 0.203: C1.2 30.56,36.23 30.5,36.17 30.5,35.71 30.56,35.65 IC1.73
N$4
  Top 0.305: IC1.48 47.81,31.67 C2.1
N$5
  Top 0.152: SPWR.C 5.97,21.14 5.69,20.85 5.69,15.71 6.16,15.24 7.82,15.24 8.34,14.72 R27.2
N$6
  Top 0.203: USB1-DEVICE+FS.2 6.84,48.59 7.22,48.97 R3.2
N$7
  Top 0.152: PWR.C 11.32,51.3 11.99,50.64 11.99,48.5 12.37,48.12 R28.2
N$8
  Top 0.203: USB1-DEVICE+FS.3 6.79,47.94 7.14,47.59 7.14,47.15 7.3,46.99 R4.2
N$9
  Top 0.254: USB1-OTG+HS.2 60.19,42.53 59.49,41.83 R5.2
N$10
  Top 0.254: R6.2 59.21,43.81 59.85,43.18 USB1-OTG+HS.3
N$11
  Top 0.152: USR2.C 9.37,19.47 9.86,19.47 10.21,19.83 10.21,20.37 10.29,20.45 R29.2
N$12
  Top 0.152: USR1.C 8.96,16.63 9.45,16.63 9.53,16.71 9.53,16.87 9.64,16.99 10.35,16.99 R30.2
N$13
  Top 0.152: COM.C 50.9,37.78 R31.2
N$21
  Top 0.152: IC2.2 15.26,26.67 R15.2 17.14,26.68 17.14,27.7 16.79,28.06 IC2.3
N$22
  Top 0.254: IC2.4 16.27,29.33 16.55,29.61 R16.2
N$23
  Top 0.254: R14.2 15.14,24.38 IC2.1
N$25
  Top 0.203: IC2.7 8.94,26.73 R11.1 R12.2
  Top 0.406: J1.1 2.34,24.59 4.36,24.59 4.94,25.18 R12.2
N$26
  Top 0.152: IC2.6 10.94,28.06 11.34,28.46 11.34,30.1 11.04,30.4 10.08,30.4 9.53,30.96 9.53,32.01 R13.1
  Top 0.203: R11.2 8.97,28.03 IC2.6
  Top 0.406: R11.2 4.46,28.23 4.43,28.23 4.21,28.01 J1.2
NRST  (via drill 0.5)
  Top 0.152: IC1.14 36.06,13.26 C18.1 | ICSP.5 67.66,30.48 67.66,22.62 66.87,21.83 66.69,21.83 66.68,21.83 66.44,21.83 66.2,21.59 66.2,9.92 65.21,8.93 65.21,4.96 66,4.17 v65.98,4.15
  Top 0.203: C18.1 36,13.27 R1.1 33.35,13.27 33.02,12.94 POWER.1
  Bottom 0.152: v65.98,4.15 64.97,3.13 64.97,1.43 64.09,0.56 33.62,0.56 33.02,1.15 POWER.1
QSPI-SCK  (via drill 0.3)
  Top 0.152: U1.6 14.68,16.31 15.35,16.98 15.35,18.21 15.94,18.8 21.95,18.8 22.52,19.37 22.52,20.31 v22.5,20.32 | v31.59,23.1 38.93,23.1 41.51,25.68 IC1.36
  Bottom 0.152: v22.5,20.32 28.81,20.32 v31.59,23.1
QSPI_BK1_IO0  (via drill 0.3)
  Top 0.152: U1.5 14.46,17.58 15.05,18.17 15.05,18.34 15.81,19.1 21.82,19.1 22.21,19.49 22.21,19.86 21.97,20.1 21.97,21.09 21.78,21.28 21.21,21.28 20.28,22.21 20.28,25.37 21.57,26.66 23.22,26.66 23.74,27.18 23.74,30 23.32,30.42 23,30.42 22.68,30.73 22.68,31.18 23.14,31.63 v23.14,31.75 | v34.05,32.58 34.06,32.59 IC1.66
  Bottom 0.152: v23.14,31.75 23.62,32.23 33.7,32.23 v34.05,32.58
QSPI_BK1_IO1  (via drill 0.3)
  Top 0.152: v23.22,30.96 24.04,30.13 24.04,27.05 23.35,26.36 21.7,26.36 20.59,25.25 20.59,22.34 21.34,21.58 23.09,21.58 23.37,21.31 23.37,16.54 22.78,15.95 20.91,15.95 20,15.04 U1.2 | v25.28,31.67 26.39,31.67 26.43,31.71 27.77,31.71 IC1.78
  Bottom 0.152: v23.22,30.96 23.93,31.67 v25.28,31.67
QSPI_BK1_IO2  (via drill 0.3)
  Top 0.152: U1.3 v19.92,16.31 | IC1.1 29.56,13.45 28.91,12.8 28.35,12.8 28.04,12.48 28.04,11.97 v27.86,11.79
  Bottom 0.152: v27.86,11.79 27.78,11.71 25.72,11.71 24.8,12.62 24.8,15.68 24.17,16.31 v19.92,16.31
QSPI_BK1_IO3  (via drill 0.3)
  Top 0.152: v40.56,15.88 IC1.23 | U1.7 13.67,14.42 15.42,14.42 15.44,14.41 20.28,14.41 v21.19,15.32 | v28.93,11.55 29.77,11.55 30.49,10.82 32.17,10.82 32.38,11.03 32.38,13.37 33.32,14.31 33.85,14.31 34.21,14.66 v34.21,14.96
  Bottom 0.152: v40.56,15.88 40.56,15.84 39.83,15.11 35.61,15.11 35.38,15.34 34.59,15.34 v34.21,14.96 | v28.93,11.55 28.54,11.15 28.43,11.25 25.74,11.25 24.5,12.49 24.5,15.19 24.37,15.32 v21.19,15.32
QSPI_BK1_NCS  (via drill 0.3)
  Top 0.152: U1.1 20.75,13.77 20.75,13.78 21.57,14.59 v22.59,14.59 | v44.89,30.96 44.6,30.67 IC1.46 | v27.06,10.52 32.61,10.52 32.69,10.6 32.69,13.24 33.45,14 34.96,14 35.16,14.21 v35.16,14.8
  Bottom 0.152: v35.16,14.8 45.52,14.8 46.4,15.68 46.4,26.59 45.19,27.8 45.19,30.66 v44.89,30.96 | 22.98,14.59 v22.59,14.59 23.81,14.59 24.2,14.21 24.2,12.37 25.61,10.95 26.63,10.95 v27.06,10.52
SD_CD  (via drill 0.35)
  Top 0.152: JP3.CD2 53.58,13.73 53.58,13.65 | 53.58,13.65 JP3.CD1 | IC1.24 41.06,18.11 44.21,14.96 48.94,14.96 48.97,15 49.71,14.27 49.71,13.28 v49.69,13.26 | v54.45,12.78 53.58,13.65
  Bottom 0.152: v54.45,12.78 54.45,12.7 54.13,12.38 50.56,12.38 v49.69,13.26
SD_DAT1
  Top 0.152: JP3.DAT1 62.27,8.54 61.57,9.25 61.57,13.27 56.16,18.68 56.16,22.98 56.22,23.04 56.22,24.11 56.04,24.29 R22.1
SD_DAT2
  Top 0.152: R17.1 61.87,23.45 63.88,21.45 JP3.DAT2
SERVO1  (via drill 0.3)
  Top 0.152: IC1.67 33.56,33.64 33.22,33.3 v33.22,32.94 | v22.86,33.3 16.94,33.3 12.85,29.2 12.85,24.32 13.4,23.76 13.4,22.99 12.59,22.18 5.38,22.18 5.38,14.94 JP6.6
  Bottom 0.152: v33.22,32.94 27.5,32.94 26.95,33.49 26.11,33.49 25.72,33.11 23.05,33.11 v22.86,33.3
SERVO2
  Top 0.152: 24.37,33.2 24.64,33.47 28.05,33.47 28.22,33.63 28.64,33.63 28.87,33.4 28.87,33.2 30.46,31.6 30.46,31.33 30.77,31.02 31.22,31.02 31.53,31.33 31.53,31.99 32.23,31.99 32.58,32.34 32.54,32.38 32.54,34.4 IC1.69
  Top 0.203: JP6.5 7.7,10.08 7.7,8.04 8.68,7.06 17.73,7.06 19.38,7.06 23.7,11.38 23.7,21.44 23.23,21.91 21.48,21.91 20.92,22.48 20.92,25.11 21.83,26.03 23.49,26.03 24.37,26.91 24.37,33.2
SERVO3
  Top 0.203: JP5.6 8.53,6.71 19.52,6.71 24.05,11.24 24.05,21.59 23.38,22.27 21.62,22.27 21.27,22.62 21.27,24.96 21.98,25.67 IC1.90
SERVO4
  Top 0.152: 24.41,22.9 24.79,23.28 24.79,24.75 25.21,25.17
  Top 0.203: JP5.5 19.67,6.35 24.41,11.09 24.41,22.9 | 25.21,25.17 IC1.91
SERVO5
  Top 0.203: JP4.6 8.39,3.81 10.29,5.71 19.54,5.71 24.77,10.94 24.77,22.75 25.18,23.16 IC1.95
SERVO6
  Top 0.203: JP4.5 10.44,5.36 19.68,5.36 25.12,10.79 25.12,22.48 25.31,22.67 IC1.96
SERVO_POWER  (via drill 0.3)
  Top 0.152: R27.1 8.76,13.42 v8.45,13.72 v8.45,13.73
  Top 1.27: JP4.3 JP5.3 | JP5.3 JP6.3 | JP6.3 JP6.4 3.81,15.74 J2.1 | JP4.4 JP5.3 | JP5.4 JP6.3
  Bottom 0.152: v8.45,13.73 7.42,12.7 5.08,12.7 JP6.4
  Bottom 0.406: JP11.3 1.51,31.39 3.21,29.69 3.69,29.69 4.45,28.93 4.45,19.47 J2.1
SPI2_MISO  (via drill 0.35)
  Top 0.152: IC1.17 37.56,19.91 37.62,19.97 37.62,20.43 37.3,20.76 36.67,20.76 36.39,21.03 v36.39,21.07
  Bottom 0.152: v36.39,21.07 36.39,21.15 36.76,21.52 36.76,22.71 36.11,23.36 36.11,24.06 36.76,24.71 36.76,40.11 31.43,45.44 IOH.5
SPI2_MOSI  (via drill 0.35)
  Top 0.152: IC1.16 37.06,20.15 37.07,20.16 v37.07,20.2
  Bottom 0.152: IOH.4 33.97,43.34 37.07,40.24 37.07,24.59 36.41,23.93 36.41,23.49 37.07,22.83 v37.07,20.2
SPI2_SCK  (via drill 0.35)
  Top 0.152: IC1.52 41.06,30.68 v36.16,30.68
  Bottom 0.152: v36.16,30.68 36.16,32.38 36.46,32.69 36.46,39.98 28.89,47.55 IOH.6
SPI2_SS  (via drill 0.3)
  Top 0.203: IOH.3 36.51,43.3 v36.39,43.3 | v38.7,39.37 v38.7,39.36 38.7,35.85 38.56,35.7 IC1.57
  Bottom 0.203: v38.7,39.37 36.51,41.55 36.51,43.18 v36.39,43.3
SPI4_MISO  (via drill 0.3)
  Top 0.152: ICSP.1 66.2,26.39 65.92,26.67 63.02,26.67 62.39,27.3 62.39,28.57 61.79,29.17 59.47,29.17 59.44,29.14 58.99,29.14 58.96,29.17 v57.63,29.17 IC1.43 | JP3.DAT0 62.11,9.64 61.87,9.88 61.87,13.4 57.82,17.45 57.82,18.61 v61.67,22.46 | R20.1 61.13,35.42 59.95,34.23 59.08,34.23 v57.63,32.78
  Bottom 0.152: v61.67,22.46 63.62,24.41 64.07,24.41 65.06,25.4 ICSP.1 | v57.63,32.78 v57.63,29.17
SPI4_MOSI  (via drill 0.3)
  Top 0.152: ICSP.4 63.7,27.98 63.7,28.89 63.42,29.17 62.71,29.17 62.21,29.67 v59.21,29.67 57.88,29.67 57.85,29.7 57.41,29.7 57.37,29.67 IC1.44 | v62.67,20.6 62.67,15.8 62.5,15.64 62.5,14.29 62.75,14.04 JP3.CMD | R18.1 57.66,35.73 v58.66,34.73
  Bottom 0.152: v62.67,20.6 64.16,22.09 64.16,22.64 64.47,22.96 64.91,22.96 65.1,22.77 66.83,22.77 68.12,24.06 68.12,31.46 67.14,32.44 65.7,32.44 64.97,31.71 64.97,29.25 ICSP.4 | v58.66,34.73 59.21,34.17 v59.21,29.67
SPI4_SCK  (via drill 0.3)
  Top 0.152: v61.32,28.22 60.87,28.67 57.88,28.67 57.85,28.64 57.41,28.64 57.37,28.67 IC1.42 | v62.19,21.55 61.79,21.15 61.79,20.32 62.36,19.75 62.36,15.93 62.2,15.76 62.2,12.45 62.83,11.83 63.87,11.83 JP3.CLK | R19.1 v59.73,34.77
  Bottom 0.152: v62.19,21.55 62.63,21.55 64.34,23.26 65.04,23.26 65.23,23.07 66.7,23.07 67.81,24.18 67.81,27.68 67.55,27.94 ICSP.3 64.93,26.67 62.55,26.67 61.32,27.9 v61.32,28.22 61.32,31.35 59.73,32.94 v59.73,34.77
SPI4_SS  (via drill 0.3)
  Top 0.152: IC1.45 53.58,30.17 | 53.58,30.17 56.48,30.17 59.85,33.54 JP7.1 | JP3.CD/DAT3 64.97,15.14 65.54,15.72 65.54,21.58 v64.69,22.42 | R21.1 53.58,30.17
  Bottom 0.152: v64.69,22.42 64.73,22.46 66.95,22.46 68.42,23.93 68.42,31.59 67.27,32.74 62.67,32.74 JP7.1
SWCLK  (via drill 0.3, 0.35)
  Top 0.152: IC1.76 26.94,32.67 26.69,32.92 v26.49,32.92 | v16.17,35.42 v12.98,32.23 | v13.69,9.75 13.66,9.75 13.65,9.76 14.02,10.13 R32.1 15.19,10.11 R33.1
  Bottom 0.152: v26.49,32.92 26.45,32.96 26.17,32.96 25.98,32.76 22.29,32.76 21.03,34.01 17.62,34.01 16.19,35.44 v16.17,35.42 | JP10.2 17.73,2.51 17.73,9.24 17.21,9.75 v13.69,9.75 12.14,9.75 11.83,10.06 11.83,30.99 11.83,31 11.83,31.07 v12.98,32.23
SWD  (via drill 0.3)
  Top 0.152: v22.23,34.09 17.3,34.09 12.54,29.33 12.54,24.19 13.09,23.64 13.09,23.11 12.48,22.5 5.25,22.5 5.08,22.33 5.08,12.74 5.12,12.7 8.02,12.7 8.02,10.23 8.03,10.22 8.03,8.18 8.82,7.39 15.01,7.39 15.38,7.76 v18.97,7.76 19.62,8.41 R35.2 21.78,10.34 22.04,10.59 R34.2 | IC1.72 v31.06,35.94
  Bottom 0.152: v22.23,34.09 22.23,34.16 23.15,35.08 28.7,35.08 28.71,35.06 28.96,35.06 29.83,35.94 v31.06,35.94 | v18.97,7.76 20.28,6.45 JP10.1
UART4_RX  (via drill 0.3)
  Top 0.152: IC1.79 26.68,31.17 26.67,31.16 v26.65,31.18
  Bottom 0.152: v26.65,31.18 25.54,31.18 25.5,31.14 24.15,31.14 23.44,30.42 23,30.42 22.54,30.88 22.54,32.06 20.9,33.71 17.5,33.71 17.08,34.12 15.88,34.12 14.35,35.65 14.35,35.94 14.03,36.25 13.59,36.25 12.78,35.44 5.76,35.44 4.41,34.09 JP9.4
UART4_TX  (via drill 0.3)
  Top 0.152: v33.14,21.03 33.68,21.58 36.11,21.58 36.16,21.63 37.11,21.63 37.27,21.47 39.21,21.47 40.06,20.62 IC1.22
  Bottom 0.152: v33.14,21.03 32.73,21.44 32.73,27.7 33.63,28.6 33.63,29.87 33.32,30.18 32.88,30.18 32.57,29.87 32.57,29.66 30.76,27.85 25.89,27.85 24.87,28.87 23.69,28.87 23.05,29.51 22.42,29.51 21.59,30.34 21.59,31.72 20.51,32.79 17.12,32.79 16.72,33.19 7.65,33.19 JP9.3
UART5_RX  (via drill 0.3)
  Top 0.152: v13.02,34.53 v13.02,34.54 12.58,34.98 9.71,34.98 9.53,35.16 5.67,35.16 JP9.6 | v25.32,29.17 IC1.83 | IC1.83
  Bottom 0.152: v13.02,34.53 14.05,33.5 16.84,33.5 17.24,33.1 20.64,33.1 21.93,31.8 21.93,30.43 22.55,29.81 23.18,29.81 23.82,29.17 v25.32,29.17
UART5_TX  (via drill 0.3)
  Top 0.152: JP9.5 9.14,36.43 9.14,35.99 9.74,35.39 9.84,35.28 13.38,35.28 v13.81,35.72 | v25.16,30.36 25.47,30.67 26.4,30.67 26.43,30.64 26.87,30.64 26.9,30.67 IC1.80
  Bottom 0.152: v13.81,35.72 15.72,33.81 16.96,33.81 17.37,33.4 20.77,33.4 22.24,31.94 22.24,30.59 22.71,30.12 23.56,30.12 23.87,30.42 25.1,30.42 v25.16,30.36
USART3_DE  (via drill 0.3)
  Top 0.152: IC1.59 37.56,33.16 37.15,32.74 37.15,31.55 36.83,31.23 35.92,31.23 35.45,30.76 34.21,30.76 v33.1,29.65 | R15.1 21.15,26.67 21.44,26.96 22.4,26.96 22.9,27.46 v22.9,27.54
  Bottom 0.152: v22.9,27.54 31,27.54 v33.1,29.65
USART3_RX  (via drill 0.3)
  Top 0.152: IC1.56 39.06,32.55 38.77,32.27 v38.76,32.29 | v38.02,24.41 37.9,24.29 30.76,24.29 v30.2,23.73 | v17.58,24.37 R14.1
  Top 0.203: IOL.1 63.5,48.94 61.18,46.62 59.29,46.62 59.06,46.39 46.79,46.39 39.06,38.66 IC1.56
  Bottom 0.152: v38.76,32.29 38.76,25.14 v38.02,24.41 | v30.2,23.73 27.54,23.73 26.6,22.79 19.16,22.79 v17.58,24.37
USART3_TX  (via drill 0.3, 0.35)
  Top 0.152: IC1.55 39.56,33.11 40.05,32.62 v40.06,32.64 | v39.77,29.33 38.26,29.33 v38.06,29.13 | v37.92,25.66 37.12,24.86 v31.48,24.86 | v18.41,28.06 18.41,29.59 R16.1
  Top 0.203: IC1.55 39.56,38.66 46.94,46.04 v59.53,46.04
  Bottom 0.152: v40.06,32.64 40.06,29.63 v39.77,29.33 | v38.06,29.13 38.06,25.76 37.94,25.64 v37.92,25.66 | v31.48,24.86 30.89,24.86 30.31,24.28 27.66,24.28 26.48,23.11 19.27,23.11 18.41,23.97 v18.41,28.06
  Bottom 0.203: v59.53,46.04 60.96,47.47 IOL.2
USART6_RX  (via drill 0.3)
  Top 0.152: v16.79,36.63 16.23,36.63 15.7,36.1 15.38,36.1 14.65,35.37 14.65,34.98 12.7,33.02 9.04,33.02 8.33,32.31 8.33,30.68 7.7,30.04 5.71,30.04 JP9.2 | v33.85,37.82 33.97,37.7 34.53,37.7 35.06,37.17 IC1.64
  Bottom 0.152: v16.79,36.63 17.46,37.31 17.46,38.19 18.3,39.03 21.68,39.03 22.32,39.66 23.2,39.66 23.23,39.7 23.68,39.7 23.99,39.39 23.99,39.07 24.03,39.03 32.65,39.03 v33.85,37.82
USART6_TX  (via drill 0.3)
  Top 0.152: v34.09,38.93 35.56,37.47 IC1.63 | JP9.1 9.59,33.99 13.24,33.99 14.35,35.1 14.35,35.5 v15.48,36.63
  Bottom 0.152: v34.09,38.93 33.7,39.33 24.48,39.33 23.8,40.01 23.11,40.01 23.07,39.97 22.2,39.97 21.56,39.33 18.18,39.33 v15.48,36.63
USB_OTG_FS_DM
  Top 0.203: IC1.70 32.06,36.8 31.92,36.94 31.92,43.8 30.63,45.08 11.32,45.08 11.27,45.14 11.27,46.78 10.83,47.21 10.83,48.72 10.58,48.97 R3.1
USB_OTG_FS_DP
  Top 0.203: IC1.71 31.56,35.65 31.62,35.71 31.62,36.17 31.56,36.23 31.56,43.65 30.48,44.73 15.76,44.73 15.64,44.73 11.15,44.73 10.91,44.97 10.91,46.63 10.55,46.99 R4.1
USB_OTG_FS_VBUS  (via drill 0.3)
  Top 0.152: IC1.68 33.06,42.19 v32.94,42.31 | SH6.2 30.72,7.62 30.88,7.78 v30.88,8.57
  Top 0.203: v8.18,43.54 6.95,43.54 6.59,43.18
  Top 0.254: v18.53,8.8 v18.53,8.81 15.8,8.81 15.37,8.39 12.7,8.39 v12.62,8.47
  Top 0.406: USB1-DEVICE+FS.1 4.99,49.25 2.98,49.25 2.5,48.78 2.5,47.9 6.59,43.82 6.59,43.18 JP11.1
  Bottom 0.152: v32.94,42.31 9.41,42.31 v8.18,43.54
  Bottom 0.254: JP11.1 6.59,39.37 5.67,38.46 2.62,38.46 1.99,37.83 1.99,31.59 3.42,30.17 3.89,30.17 4.93,29.13 4.93,20.23 9.8,15.36 9.8,8.02 12.17,8.02 v12.62,8.47 | v18.53,8.8 25.51,8.8 25.73,8.57 v30.88,8.57
USB_OTG_HS_ID
  Top 0.203: USB1-OTG+HS.4 62.17,43.83 62.59,43.42 61.74,42.57 61.74,41.58 61.59,41.43 60.59,41.43 58.62,39.45 47.43,39.45 42.74,34.77 42.74,34.45 42.72,34.42 IC1.51
USB_OTG_HS_N
  Top 0.203: 41.71,37.54 41.71,37.59 40.56,36.44 IC1.53
  Top 1.27: R5.1 46,41.83 41.71,37.54
USB_OTG_HS_P
  Top 0.152: 40.59,38.43 40.46,38.31 40.46,38.28
  Top 0.203: IC1.54 40.06,37.88 40.46,38.28 40.64,38.46
  Top 1.27: 40.59,38.43 45.97,43.81 R6.1
USR1  (via drill 0.3)
  Top 0.152: IC1.97 25.98,22.17 v25.84,22.03 | USR2.A 7.18,18.81 7.18,20.08 9.6,20.08 9.6,21.63 9.85,21.88 12.74,21.88 12.81,21.88 15.63,21.88 v16.83,20.68
  Bottom 0.152: v25.84,22.03 18.18,22.03 v16.83,20.68
USR2  (via drill 0.3)
  Top 0.152: IC1.98 26.75,21.67 26.15,21.07 26.07,21.07 v26.07,21.11 | USR1.A 7.18,17.42 7.38,17.42 7.94,17.98 7.94,19.61 8.11,19.78 9.73,19.78 9.91,19.96 9.91,21.43 10.05,21.57 15.18,21.57 16.61,20.14 17.68,20.14 v17.78,20.04
  Bottom 0.152: v26.07,21.11 26,21.11 25.4,21.71 18.29,21.71 17.74,21.16 17.74,20.04 v17.78,20.04
VDD  (via drill 0.3, 0.35, 0.5)
  Top 0.152: IC1.21 39.56,13.26 C7.1 | ICSP.2 59.09,25.4 | R13.2 12.06,31.01 12.06,30.96 | R24.2 20.23,40.55 18.8,39.12 | R30.1 11.11,19.05 12.5,19.05 12.9,19.45 R29.1 13.96,20.45 v14.17,20.24 | R31.1 52.62,36.2 52.63,36.2 | R28.1 14.35,46.41 v14.37,46.4 | v14.37,43.81 14.37,40.55 | 57.74,26.88 57.29,26.88 57.07,27.11 56.06,27.11 R22.2 | R17.2 58.44,24.75 59.09,25.4 | C3.2 58.4,26.09 59.09,25.4 | R21.2 54.75,33.08 55.24,33.58 | C9.1 15.1,11.91 R32.2 15.18,12.33 15.6,12.75 18.15,12.75 18.87,12.03 R35.1
  Top 0.203: C8.1 26.11,36.35 28.77,36.35 29.57,35.56 IC1.75 | R1.2 34.09,7.82 35.56,6.35 | C7.1 38.47,13.23 37.47,12.22 | IC1.100 26.9,20.67 26.39,20.16 C11.1 | C20.+ 20.32,37.61 20.32,38.1 | C15.2 31.59,17.22 32.07,17.7 IC1.6 | IC1.11 34.56,17.69 34.33,17.46 33.66,17.46 33.24,17.05 C13.2 | JP3.VCC 65.52,12.94 65.87,13.29 65.87,23.19 ICSP.2 | R18.2 57.67,37.44 R19.2 61.8,37.29 R20.2 | C3.2 57.74,26.88 | SH5.2 31.51,7.34 v31.59,7.42 | 24.58,38.12 24.61,38.1 | R26.2 25.01,41.83 24.78,41.61 R23.2 24.78,38.12 24.8,38.1
  Top 0.254: 20.32,38.1 24.61,38.1 24.8,38.1 25.2,38.1 26.11,37.19 26.11,36.35 | IC2.8 9.23,25.28 C19.2 | C14.2 37.96,16.33 36.47,14.84 36.47,14.24 36.82,13.9 36.82,12.87 37.47,12.22
  Top 0.305: IC1.50 45.65,32.67 46.71,33.73 C10.1 | IC1.27 46.46,21.17 C16.2 | U1.8 15,13.77 15.12,13.89 v15.2,13.89 | C15.2 30.54,16.84 30.36,17.03 v30.32,17.03
  Top 0.406: POWER.2 35.56,6.35 36.63,6.35 37.47,7.18 37.47,8.89 | 37.47,12.22 37.47,8.89 | C11.1 27.49,18.79 v27.78,18.49 | v12.46,23.38 11.15,24.69 11.15,25.52 | 37.47,8.89 38.06,9.48 41.39,9.48 | 41.39,9.48 45.56,9.48 48.18,12.11 v48.18,14.09 | v48.18,16.39 48.18,17.62 47.51,18.3 | 47.51,18.3 47.51,18.31 C16.2 | v56.08,32.74 55.24,33.58 54.02,34.81 | 54.02,34.81 52.63,36.2 48.74,36.2 47.89,35.34 C10.1 | U1.8 13.19,13.63 C9.1 | R18.2 56.65,37.46 54.02,34.83 54.02,34.81 | C12.1 40.68,8.77 41.39,9.48 | C7.1 40.48,13.23 41.58,12.13 C6.1 | 47.51,18.3 47.47,18.34 46.35,18.34 45.44,19.25 C5.1 | C4.2 27.89,9.16 v28.38,9.64
  Top 0.508: C20.+ 20.03,37.53 12.06,29.57 | 12.06,30.96 12.06,29.57 | IC2.8 11.15,25.52 12.06,26.43 12.06,29.53 12.06,29.54 12.06,29.57 | C15.2 31.96,16.47 C13.2
  Top 0.61: IC3.2 14.37,40.55 17.38,40.55 18.8,39.12 C20.+
  Bottom 0.152: v14.17,20.24 15.54,20.24 15.59,20.29 | v14.37,46.4 v14.37,43.81
  Bottom 0.203: v31.59,7.42 32.37,8.2 32.45,8.2
  Bottom 0.305: v15.2,13.89 15.2,17.66 16.71,19.17 | v30.32,17.03 29.25,17.03 29.11,17.16
  Bottom 0.406: 30.52,10.12 29.65,10.99 29.65,16.63 29.11,17.16 v27.78,18.49 17.38,18.49 16.71,19.17 15.59,20.29 12.5,23.38 v12.46,23.38 | 30.52,10.12 32.45,8.2 35.56,5.08 POWER.2 | v48.18,14.09 v48.18,16.39 55.02,23.23 55.02,23.53 56.38,24.89 | 56.38,24.89 56.89,25.4 ICSP.2 | 56.38,24.89 56.08,25.2 v56.08,32.74 | v28.38,9.64 30.04,9.64 30.52,10.12
VINP
  Top 0.406: C22.1 IC3.3 4.45,38.26 4.05,38.66 JP11.2
VREF+  (via drill 0.3)
  Top 0.152: IC1.20 39.01,20.24 39.13,20.36 v39.17,20.36 | v36.94,23.71 v35.08,23.71 | R25.2 28.39,37.43 28.38,37.43 v28.38,37.41 | v28.21,35.73 29.17,34.76 29.17,33.33 30.95,31.55 v31,31.55 | v30,28.93 30.4,29.33 32.34,29.33 33.81,27.86 34.77,27.86 v35.08,28.18
  Bottom 0.152: v39.17,20.36 39.18,22.85 38.32,23.71 v36.94,23.71 | v28.38,37.41 28.38,35.88 28.22,35.71 v28.21,35.73 | v31,31.55 29.53,31.55 29.33,31.35 29.33,28.97 29.37,28.93 v30,28.93 | v35.08,28.18 v35.08,23.71 35.08,23.69
VREF_ARDUINO  (via drill 0.3)
  Top 0.152: R25.1 26.71,40.93 R26.1 28.29,43.17 v28.42,43.3
  Bottom 0.152: v28.42,43.3 28.42,45.16 26.87,46.71 24.96,46.71 23.81,47.86 IOH.8

### Text on the board
tNames: D0 | D9 | D8 | D7 | D6 | D5 | D4 | D3 | D2 | D1 | SCL | SDA | REF | GND | D13 | D12 | D11 | D10 | S1 | SERVOS | S2 | A3 | S3 | A0 | A2 | S4 | A1 | A4 | A5 | SWCK | SWD | DAC2 | DAC1 | IORef | Reset | 3V3 | 5V | GND | GND | Vin | S5 | S6